# EAGLE design adapter (EAGLE 6.5.0)
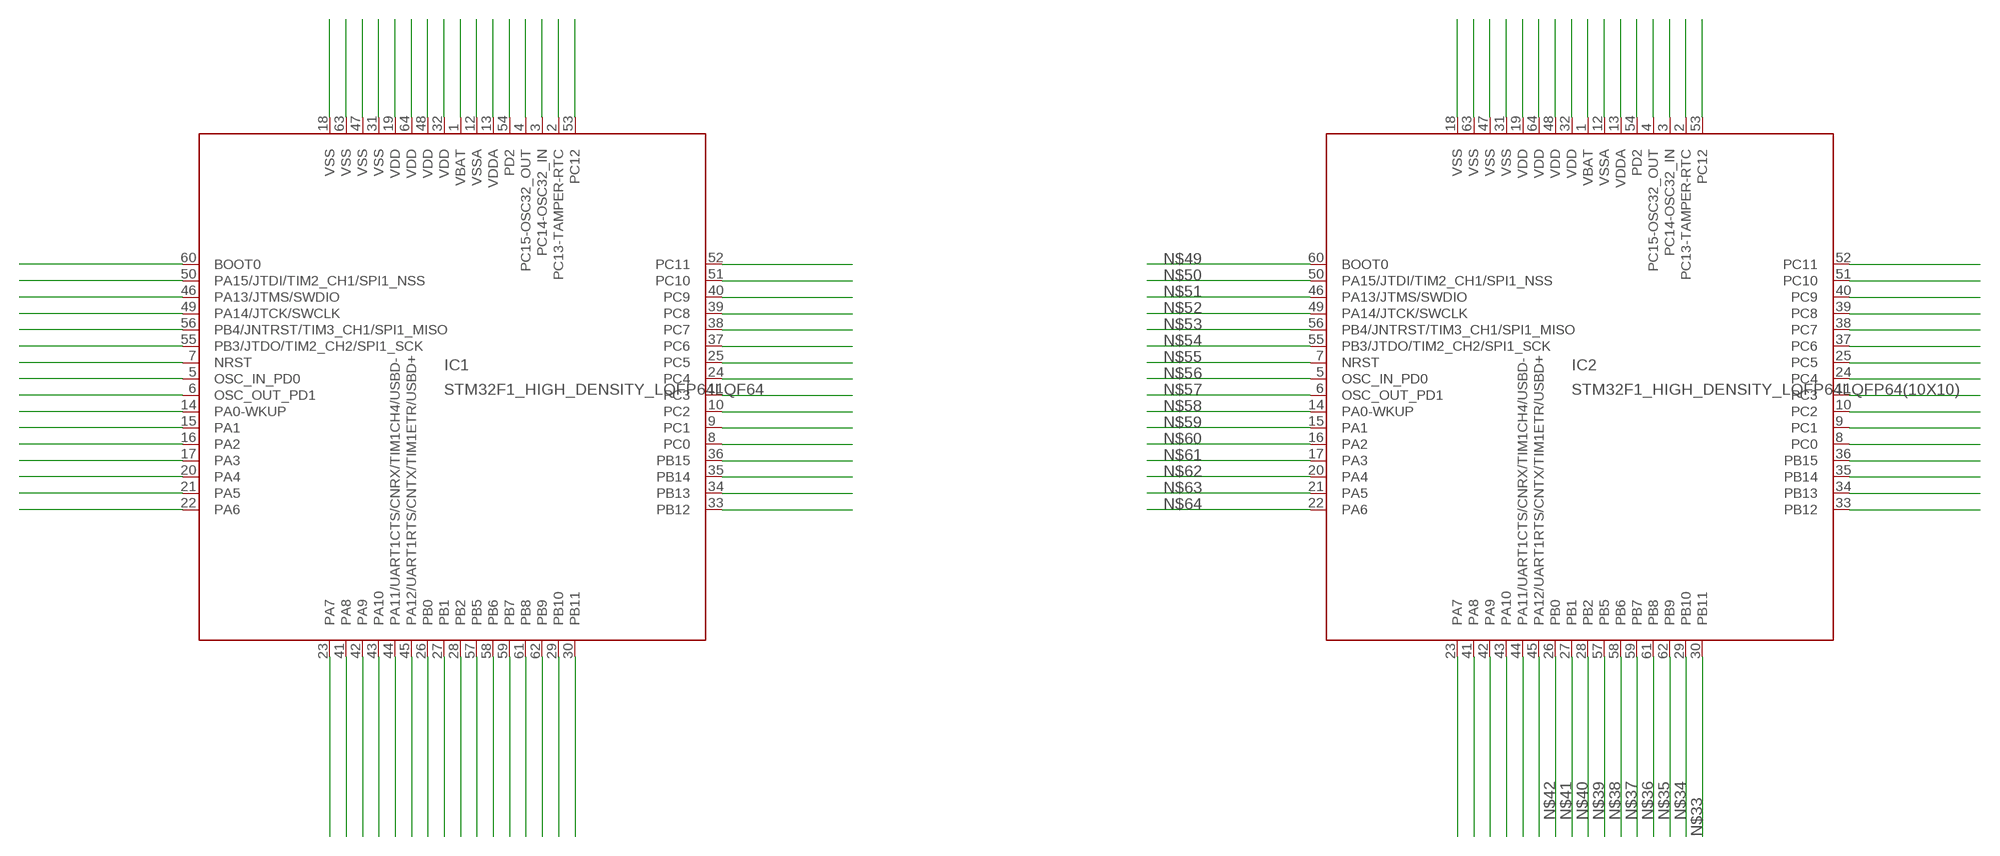
[diagram p0: schematic, sheet 1]

## Parts
IC1  STM32F1_HIGH_DENSITY_LQFP64LQF64  [LQFP64_PACKAGE]
IC2  STM32F1_HIGH_DENSITY_LQFP64LQFP64(10X10)  [LQFP64A_PACKAGE]

## Nets
N$1: IC1.1(VBAT) IC2.1(VBAT)
N$2: IC1.2(PC13-TAMPER-RTC) IC2.2(PC13-TAMPER-RTC)
N$3: IC1.18(VSS) IC2.18(VSS)
N$4: IC1.3(PC14-OSC32_IN) IC2.3(PC14-OSC32_IN)
N$5: IC1.4(PC15-OSC32_OUT) IC2.4(PC15-OSC32_OUT)
N$6: IC1.63(VSS) IC2.63(VSS)
N$7: IC1.47(VSS) IC2.47(VSS)
N$8: IC1.31(VSS) IC2.31(VSS)
N$9: IC1.19(VDD) IC2.19(VDD)
N$10: IC1.64(VDD) IC2.64(VDD)
N$11: IC1.48(VDD) IC2.48(VDD)
N$12: IC1.32(VDD) IC2.32(VDD)
N$13: IC1.12(VSSA) IC2.12(VSSA)
N$14: IC1.13(VDDA) IC2.13(VDDA)
N$15: IC1.54(PD2) IC2.54(PD2)
N$16: IC1.53(PC12) IC2.53(PC12)
N$17: IC1.52(PC11) IC2.52(PC11)
N$18: IC1.51(PC10) IC2.51(PC10)
N$19: IC1.40(PC9) IC2.40(PC9)
N$20: IC1.39(PC8) IC2.39(PC8)
N$21: IC1.38(PC7) IC2.38(PC7)
N$22: IC1.37(PC6) IC2.37(PC6)
N$23: IC1.25(PC5) IC2.25(PC5)
N$24: IC1.24(PC4) IC2.24(PC4)
N$25: IC1.11(PC3) IC2.11(PC3)
N$26: IC1.10(PC2) IC2.10(PC2)
N$27: IC1.9(PC1) IC2.9(PC1)
N$28: IC1.8(PC0) IC2.8(PC0)
N$29: IC1.36(PB15) IC2.36(PB15)
N$30: IC1.35(PB14) IC2.35(PB14)
N$31: IC1.34(PB13) IC2.34(PB13)
N$32: IC1.33(PB12) IC2.33(PB12)
N$33: IC1.30(PB11) IC2.30(PB11)
N$34: IC1.29(PB10) IC2.29(PB10)
N$35: IC1.62(PB9) IC2.62(PB9)
N$36: IC1.61(PB8) IC2.61(PB8)
N$37: IC1.59(PB7) IC2.59(PB7)
N$38: IC1.58(PB6) IC2.58(PB6)
N$39: IC1.57(PB5) IC2.57(PB5)
N$40: IC1.28(PB2) IC2.28(PB2)
N$41: IC1.27(PB1) IC2.27(PB1)
N$42: IC1.26(PB0) IC2.26(PB0)
N$43: IC1.45(PA12/UART1RTS/CNTX/TIM1ETR/USBD+) IC2.45(PA12/UART1RTS/CNTX/TIM1ETR/USBD+)
N$44: IC1.43(PA10) IC2.43(PA10)
N$45: IC1.44(PA11/UART1CTS/CNRX/TIM1CH4/USBD-) IC2.44(PA11/UART1CTS/CNRX/TIM1CH4/USBD-)
N$46: IC1.42(PA9) IC2.42(PA9)
N$47: IC1.41(PA8) IC2.41(PA8)
N$48: IC1.23(PA7) IC2.23(PA7)
N$49: IC1.60(BOOT0) IC2.60(BOOT0)
N$50: IC1.50(PA15/JTDI/TIM2_CH1/SPI1_NSS) IC2.50(PA15/JTDI/TIM2_CH1/SPI1_NSS)
N$51: IC1.46(PA13/JTMS/SWDIO) IC2.46(PA13/JTMS/SWDIO)
N$52: IC1.49(PA14/JTCK/SWCLK) IC2.49(PA14/JTCK/SWCLK)
N$53: IC1.56(PB4/JNTRST/TIM3_CH1/SPI1_MISO) IC2.56(PB4/JNTRST/TIM3_CH1/SPI1_MISO)
N$54: IC1.55(PB3/JTDO/TIM2_CH2/SPI1_SCK) IC2.55(PB3/JTDO/TIM2_CH2/SPI1_SCK)
N$55: IC1.7(NRST) IC2.7(NRST)
N$56: IC1.5(OSC_IN_PD0) IC2.5(OSC_IN_PD0)
N$57: IC1.6(OSC_OUT_PD1) IC2.6(OSC_OUT_PD1)
N$58: IC1.14(PA0-WKUP) IC2.14(PA0-WKUP)
N$59: IC1.15(PA1) IC2.15(PA1)
N$60: IC1.16(PA2) IC2.16(PA2)
N$61: IC1.17(PA3) IC2.17(PA3)
N$62: IC1.20(PA4) IC2.20(PA4)
N$63: IC1.21(PA5) IC2.21(PA5)
N$64: IC1.22(PA6) IC2.22(PA6)

## Library data of the parts
IC1 IC2 = adapter:STM32F1_HIGH_DENSITY_LQFP64: STM32F1_High_density_LQFP64 edit this description Auto generated by make-symbol-device-package-bsdl.ulp Rev. 43 Source: STM32F1_High_density_LQFP64.bsd

## Board
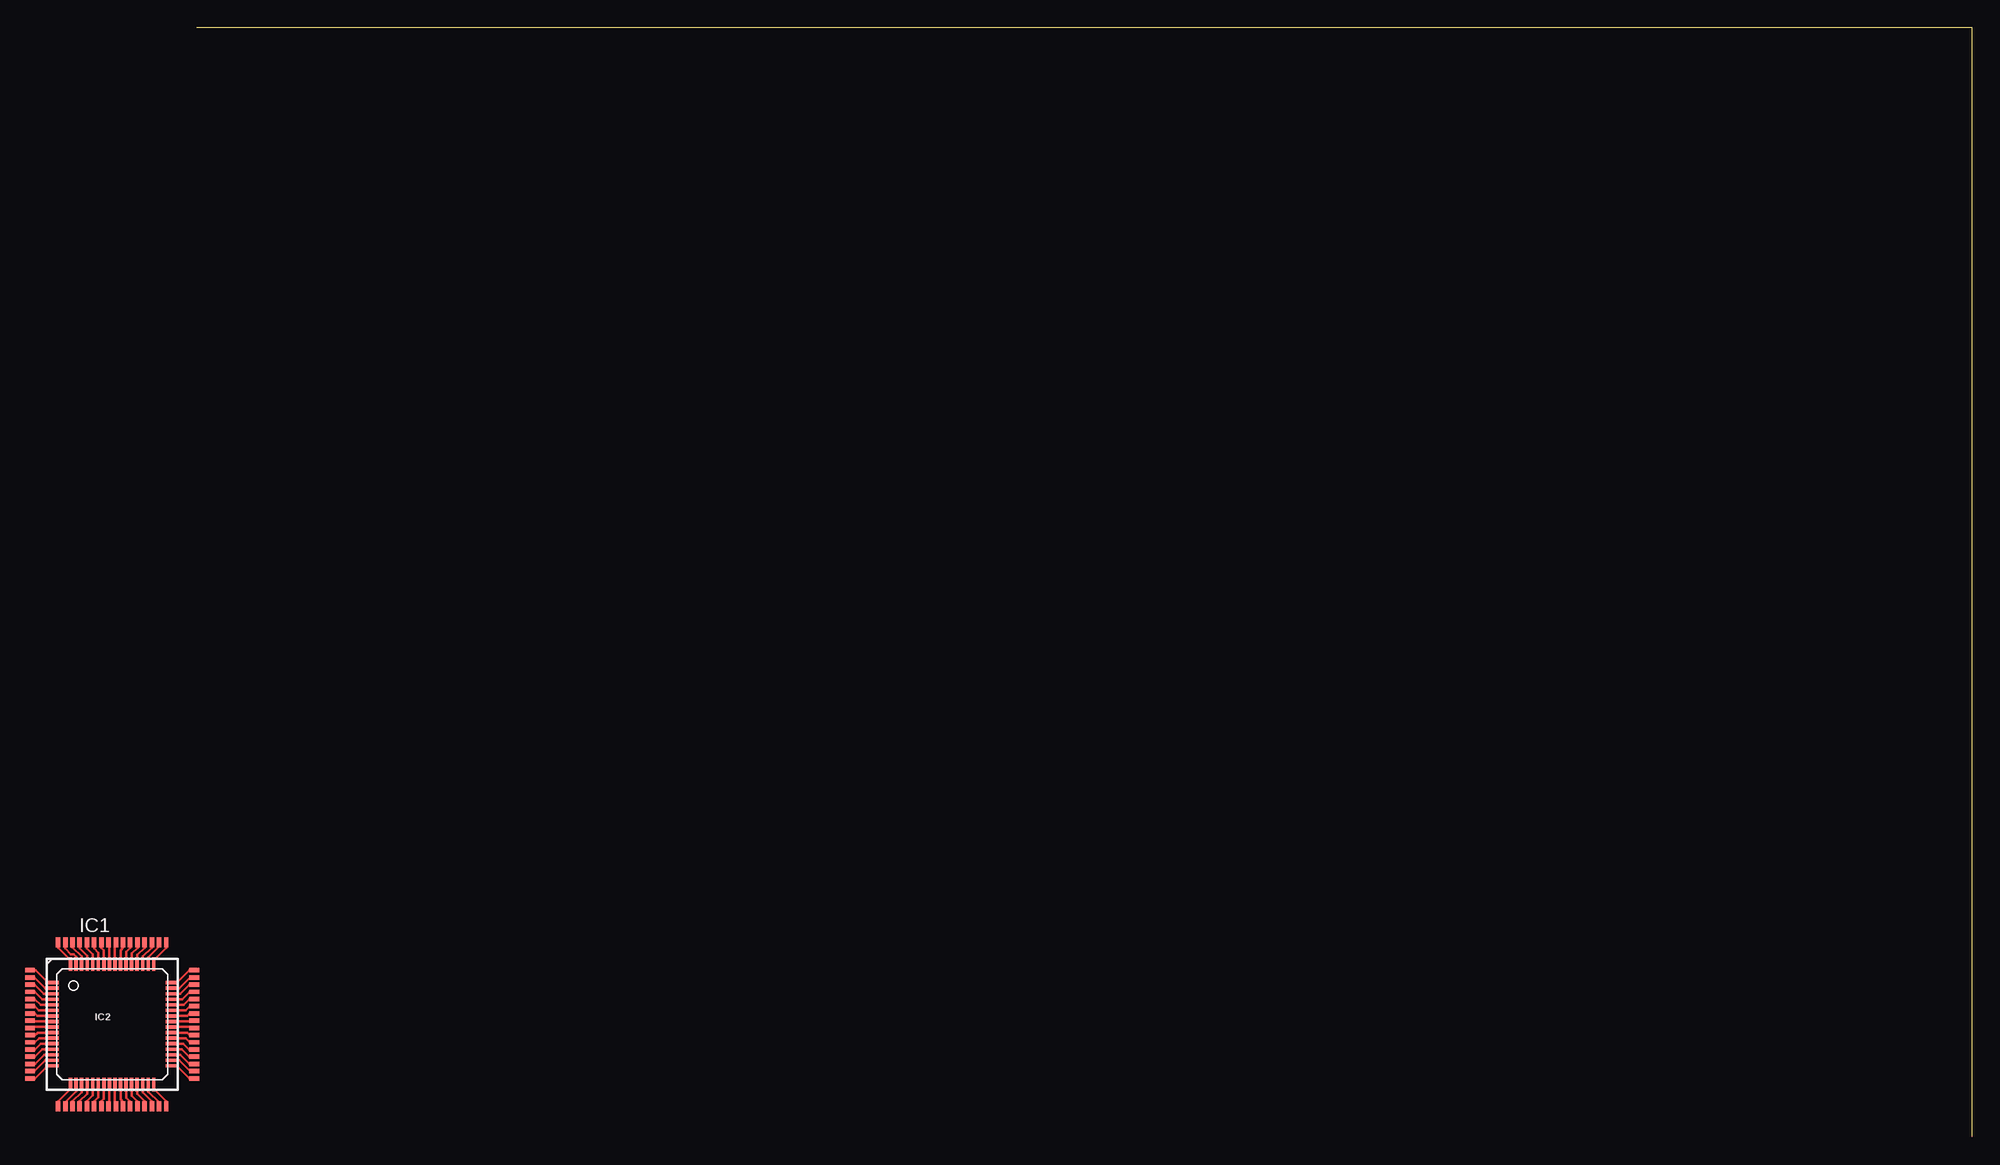
[diagram p1: board, top side]

Size 160 x 100 mm. Coordinates in mm from the lower left corner, seen from the top.
Outline: 160,0 160,100 0,100
Copper layers (1*16): Top 0.035mm / dielectric 1.5mm / Bottom 0.035mm
Design rules "default *": minimum track width 6mil, minimum drill 14mil, track to track 6mil, track to pad 6mil, pad to pad 6mil, via to via 6mil, smd to smd 6mil, copper to edge 40mil, drill to drill 8mil, minimum pad ring 10mil, minimum via ring 8mil, stop-mask expansion 4mil, vias tented up to drill 0mil, thermal gap 10mil

### Footprints (pad centres in the part's own frame; a part is rotated, then mirrored left to right if it is on the bottom)
LQFP64_PACKAGE = smd 0.9 x 0.4: 1 -7.406,4.875; 2 -7.406,4.225; 3 -7.406,3.575; 4 -7.406,2.925; 5 -7.406,2.275; 6 -7.406,1.625; 7 -7.406,0.975; 8 -7.406,0.325; 9 -7.406,-0.325; 10 -7.406,-0.975; 11 -7.406,-1.625; 12 -7.406,-2.275; 13 -7.406,-2.925; 14 -7.406,-3.575; 15 -7.406,-4.225; 16 -7.406,-4.875; 33 7.406,-4.875; 34 7.406,-4.225; 35 7.406,-3.575; 36 7.406,-2.925; 37 7.406,-2.275; 38 7.406,-1.625; 39 7.406,-0.975; 40 7.406,-0.325; 41 7.406,0.325; 42 7.406,0.975; 43 7.406,1.625; 44 7.406,2.275; 45 7.406,2.925; 46 7.406,3.575; 47 7.406,4.225; 48 7.406,4.875 | smd 0.4 x 0.9: 17 -4.875,-7.406; 18 -4.225,-7.406; 19 -3.575,-7.406; 20 -2.925,-7.406; 21 -2.275,-7.406; 22 -1.625,-7.406; 23 -0.975,-7.406; 24 -0.325,-7.406; 25 0.325,-7.406; 26 0.975,-7.406; 27 1.625,-7.406; 28 2.275,-7.406; 29 2.925,-7.406; 30 3.575,-7.406; 31 4.225,-7.406; 32 4.875,-7.406; 49 4.875,7.406; 50 4.225,7.406; 51 3.575,7.406; 52 2.925,7.406; 53 2.275,7.406; 54 1.625,7.406; 55 0.975,7.406; 56 0.325,7.406; 57 -0.325,7.406; 58 -0.975,7.406; 59 -1.625,7.406; 60 -2.275,7.406; 61 -2.925,7.406; 62 -3.575,7.406; 63 -4.225,7.406; 64 -4.875,7.406
LQFP64A_PACKAGE = smd 1.2 x 0.3: 1 -5.42,3.75; 2 -5.42,3.25; 3 -5.42,2.75; 4 -5.42,2.25; 5 -5.42,1.75; 6 -5.42,1.25; 7 -5.42,0.75; 8 -5.42,0.25; 9 -5.42,-0.25; 10 -5.42,-0.75; 11 -5.42,-1.25; 12 -5.42,-1.75; 13 -5.42,-2.25; 14 -5.42,-2.75; 15 -5.42,-3.25; 16 -5.42,-3.75; 33 5.42,-3.75; 34 5.42,-3.25; 35 5.42,-2.75; 36 5.42,-2.25; 37 5.42,-1.75; 38 5.42,-1.25; 39 5.42,-0.75; 40 5.42,-0.25; 41 5.42,0.25; 42 5.42,0.75; 43 5.42,1.25; 44 5.42,1.75; 45 5.42,2.25; 46 5.42,2.75; 47 5.42,3.25; 48 5.42,3.75 | smd 0.3 x 1.2: 17 -3.75,-5.42; 18 -3.25,-5.42; 19 -2.75,-5.42; 20 -2.25,-5.42; 21 -1.75,-5.42; 22 -1.25,-5.42; 23 -0.75,-5.42; 24 -0.25,-5.42; 25 0.25,-5.42; 26 0.75,-5.445; 27 1.25,-5.445; 28 1.75,-5.445; 29 2.25,-5.445; 30 2.75,-5.445; 31 3.25,-5.445; 32 3.75,-5.445; 49 3.75,5.42; 50 3.25,5.42; 51 2.75,5.42; 52 2.25,5.42; 53 1.75,5.42; 54 1.25,5.42; 55 0.75,5.42; 56 0.25,5.42; 57 -0.25,5.42; 58 -0.75,5.42; 59 -1.25,5.42; 60 -1.75,5.42; 61 -2.25,5.42; 62 -2.75,5.42; 63 -3.25,5.42; 64 -3.75,5.42

### Placement (x,y rotation side)
IC1  -7.62,10.16 0 top
IC2  -7.62,10.16 0 top

### Tracks (layer width: path | path; a pad name or v marks a point on that pad's centre or on a via)
N$1
  Top 0.203: IC1.1 -14.5,15.04 -13.38,13.91 IC2.1
N$2
  Top 0.203: IC2.2 -13.66,13.41 -14.64,14.38 IC1.2
N$3
  Top 0.203: IC2.18 -10.87,4.12 -11.85,3.14 IC1.18
N$4
  Top 0.203: IC1.3 -15.01,13.72 -14.58,13.72 -13.77,12.91 IC2.3
N$5
  Top 0.203: IC1.4 -14.58,13.08 -13.91,12.41 IC2.4
N$6
  Top 0.203: IC1.63 -11.86,17.55 -11.86,16.99 -11.35,16.48 -11.1,16.48 -10.87,16.25 IC2.63
N$7
  Top 0.203: IC2.47 -1.57,13.41 -0.6,14.38 IC1.47
N$8
  Top 0.203: IC2.31 -4.37,4.09 -3.4,3.12 IC1.31
N$9
  Top 0.203: IC1.19 -11.2,2.76 -11.2,3.2 -10.37,4.03 IC2.19
N$10
  Top 0.203: IC1.64 -12.5,17.07 -11.37,15.94 IC2.64
N$11
  Top 0.203: IC1.48 -0.69,15.04 -1.81,13.91 IC2.48
N$12
  Top 0.203: IC1.32 -2.74,3.23 -3.87,4.35 IC2.32
N$13
  Top 0.203: IC1.12 -15.02,7.87 -14.58,7.87 -14.04,8.41 IC2.12
N$14
  Top 0.203: IC1.13 -14.58,7.24 -13.91,7.91 IC2.13
N$15
  Top 0.203: IC1.54 -5.99,17.07 -6.37,16.69 IC2.54
N$16
  Top 0.203: IC1.53 -5.33,17.55 -5.33,17.07 -5.87,16.53 IC2.53
N$17
  Top 0.203: IC1.52 -4.7,17.07 -5.37,16.4 IC2.52
N$18
  Top 0.203: IC1.51 -4.06,17.55 -4.06,17.07 -4.87,16.26 IC2.51
N$19
  Top 0.203: IC1.40 -0.29,9.91 IC2.40
N$20
  Top 0.203: IC1.39 -0.23,9.17 -0.64,9.17 -0.88,9.41 IC2.39
N$21
  Top 0.203: IC1.38 -0.64,8.53 -1.01,8.91 IC2.38
N$22
  Top 0.203: IC1.37 -0.23,7.87 -0.66,7.87 -1.2,8.41 IC2.37
N$23
  Top 0.203: IC1.25 -7.37,2.83 IC2.25
N$24
  Top 0.203: IC1.24 -7.87,2.83 IC2.24
N$25
  Top 0.203: IC1.11 -14.58,8.53 -14.2,8.91 IC2.11
N$26
  Top 0.203: IC1.10 -15.01,9.17 -14.58,9.17 -14.34,9.41 IC2.10
N$27
  Top 0.203: IC1.9 -14.95,9.91 IC2.9
N$28
  Top 0.203: IC1.8 -14.95,10.41 IC2.8
N$29
  Top 0.203: IC1.36 -0.24,7.21 -0.66,7.21 -1.36,7.91 IC2.36
N$30
  Top 0.203: IC1.35 -0.66,6.58 -1.49,7.41 IC2.35
N$31
  Top 0.203: IC2.34 -1.57,6.91 -0.6,5.93 IC1.34
N$32
  Top 0.203: IC1.33 -0.69,5.28 -1.81,6.41 IC2.33
N$33
  Top 0.203: IC1.30 -4.06,2.77 -4.06,3.2 -4.87,4.01 IC2.30
N$34
  Top 0.203: IC1.29 -4.7,3.2 -5.37,3.87 IC2.29
N$35
  Top 0.203: IC1.62 -11.2,17.09 -10.37,16.26 IC2.62
N$36
  Top 0.203: IC1.61 -10.54,17.02 -9.87,16.35 IC2.61
N$37
  Top 0.203: IC1.59 -9.25,16.99 -8.87,16.62 IC2.59
N$38
  Top 0.203: IC1.58 -8.59,17.56 -8.59,17.04 -8.37,16.83 IC2.58
N$39
  Top 0.203: IC1.57 -7.87,17.49 IC2.57
N$40
  Top 0.203: IC1.28 -5.36,2.77 -5.36,3.2 -5.87,3.71 IC2.28
N$41
  Top 0.203: IC1.27 -6.02,2.78 -6.02,3.2 -6.37,3.55 IC2.27
N$42
  Top 0.203: IC1.26 -6.66,2.76 -6.66,3.17 -6.87,3.39 IC2.26
N$43
  Top 0.203: IC1.45 -0.24,13.06 -0.66,13.06 -1.31,12.41 IC2.45
N$44
  Top 0.203: IC1.43 -0.64,11.79 -1.01,11.41 IC2.43
N$45
  Top 0.203: IC1.44 -0.23,12.42 -0.66,12.42 -1.17,11.91 IC2.44
N$46
  Top 0.203: IC1.42 -0.25,11.1 -0.66,11.1 -0.85,10.91 IC2.42
N$47
  Top 0.203: IC1.41 -0.29,10.41 IC2.41
N$48
  Top 0.203: IC1.23 -8.61,2.77 -8.61,3.2 -8.37,3.44 IC2.23
N$49
  Top 0.203: IC1.60 -9.91,17.55 -9.91,16.99 -9.37,16.46 IC2.60
N$50
  Top 0.203: IC2.50 -4.37,16.2 -3.4,17.18 IC1.50
N$51
  Top 0.203: IC1.46 -0.23,13.72 -0.66,13.72 -1.47,12.91 IC2.46
N$52
  Top 0.203: IC1.49 -2.74,17.04 -3.87,15.92 IC2.49
N$53
  Top 0.203: IC1.56 -7.37,17.49 IC2.56
N$54
  Top 0.203: IC1.55 -6.66,17.56 -6.66,17.04 -6.87,16.83 IC2.55
N$55
  Top 0.203: IC1.7 -15.02,11.12 -14.58,11.12 -14.36,10.91 IC2.7
N$56
  Top 0.203: IC1.5 -15.01,12.42 -14.58,12.42 -14.07,11.91 IC2.5
N$57
  Top 0.203: IC1.6 -14.61,11.79 -14.23,11.41 IC2.6
N$58
  Top 0.203: IC1.14 -14.55,6.58 -13.72,7.41 IC2.14
N$59
  Top 0.203: IC2.15 -13.66,6.91 -14.64,5.93 IC1.15
N$60
  Top 0.203: IC1.16 -15,5.26 -14.58,5.26 -13.43,6.41 IC2.16
N$61
  Top 0.203: IC1.17 -12.5,3.23 -11.37,4.35 IC2.17
N$62
  Top 0.203: IC1.20 -10.57,2.78 -10.57,3.2 -9.87,3.9 IC2.20
N$63
  Top 0.203: IC1.21 -9.91,2.77 -9.91,3.2 -9.37,3.74 IC2.21
N$64
  Top 0.203: IC1.22 -9.25,3.2 -8.87,3.58 IC2.22